# EAGLE design StartLightGate2022 (EAGLE 9.6.2)
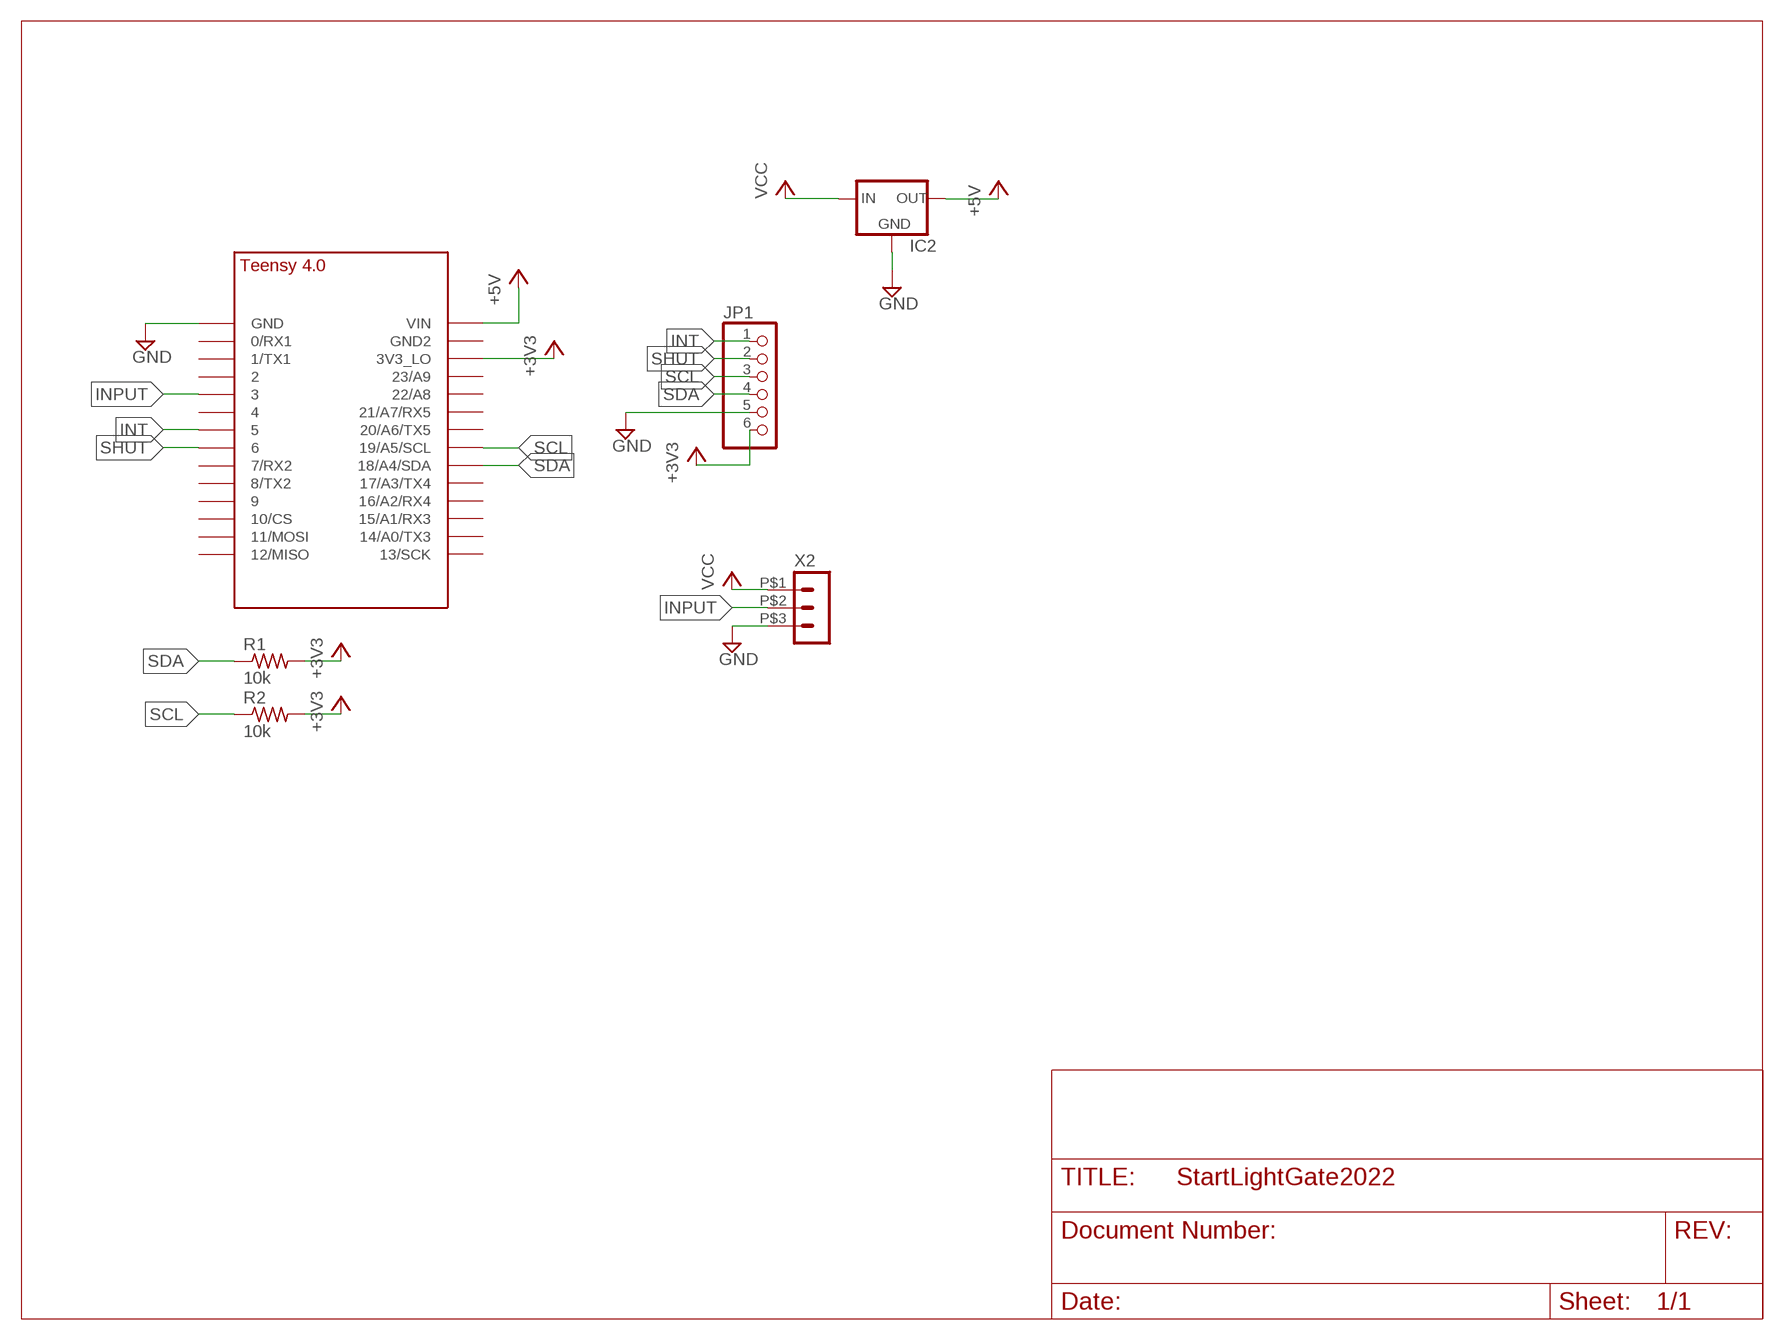
[diagram p0: schematic, sheet 1]

## Parts
IC2  REG_5V_L7805_HOR  [TO-220-H]
JP1  PINHD-1X6  [1X06]
R1  10k  RES_AXIAL1/4W-0.4  [1/4W-0.4]
R2  10k  RES_AXIAL1/4W-0.4  [1/4W-0.4]
U$1  TEENSY_4.0_SIMPLE  [TEENSY_4.0_SIMPLE]
X2  HEADER_POS3_43650-0300  [43650-0300]

## Nets
+3V3: JP1.6 R1.2 R2.2 U$1.3V3_LO
+5V: IC2.3(OUT) U$1.VIN
GND: IC2.2(GND) JP1.5 U$1.GND X2.P$3
INPUT: U$1.3/CANTX X2.P$2
INT: JP1.1 U$1.5
SCL: JP1.3 R2.1 U$1.19/A5/SCL
SDA: JP1.4 R1.1 U$1.18/A4/SDA
SHUT: JP1.2 U$1.6
VCC: IC2.1(IN) X2.P$1
Unconnected: U$1.0/RX(0/RX1) U$1.1/TX(1/TX1) U$1.2 U$1.4/CANRX U$1.7(7/RX2) U$1.8(8/TX2) U$1.9/CS U$1.10/CS U$1.11/MOSI U$1.12/MISO U$1.13/SCK U$1.14/A0(14/A0/TX3) U$1.15/A1(15/A1/RX3) U$1.16/A2(16/A2/RX4) U$1.17/A3(17/A3/TX4) U$1.20/A6(20/A6/TX5) U$1.21/A7(21/A7/RX5) U$1.22/A8 U$1.23/A9 U$1.GND2

## Library data of the parts
IC2 = GTOR - Active Components:REG_5V_L7805: Voltage Regulator Switching 5v regulator Datasheet <http://power.murata.com/data/power/oki-78sr.pdf> Standard 7805 5V regulator. IGO (Input Ground Output). Spark Fun Electronics SKU : COM-00107 Datasheet <http://www.mouser.com/ds/2/308/MC7800-D-94905.pdf>
JP1 = GTOR - Connectors:PINHD-1X6: PIN HEADER
R1 R2 = GTOR - Passive Components:RES_AXIAL: RESISTOR, American symbol; SPICEPREFIX: R
U$1 = GTOR - Microcontroller:TEENSY_4.0_SIMPLE
X2 = GTOR - Microfit Connector:HEADER_POS3_?: Molex - Micro-Fit 3.0 Series connector, 3.00mm (0.118") pitch header, 3 positions.

## Board
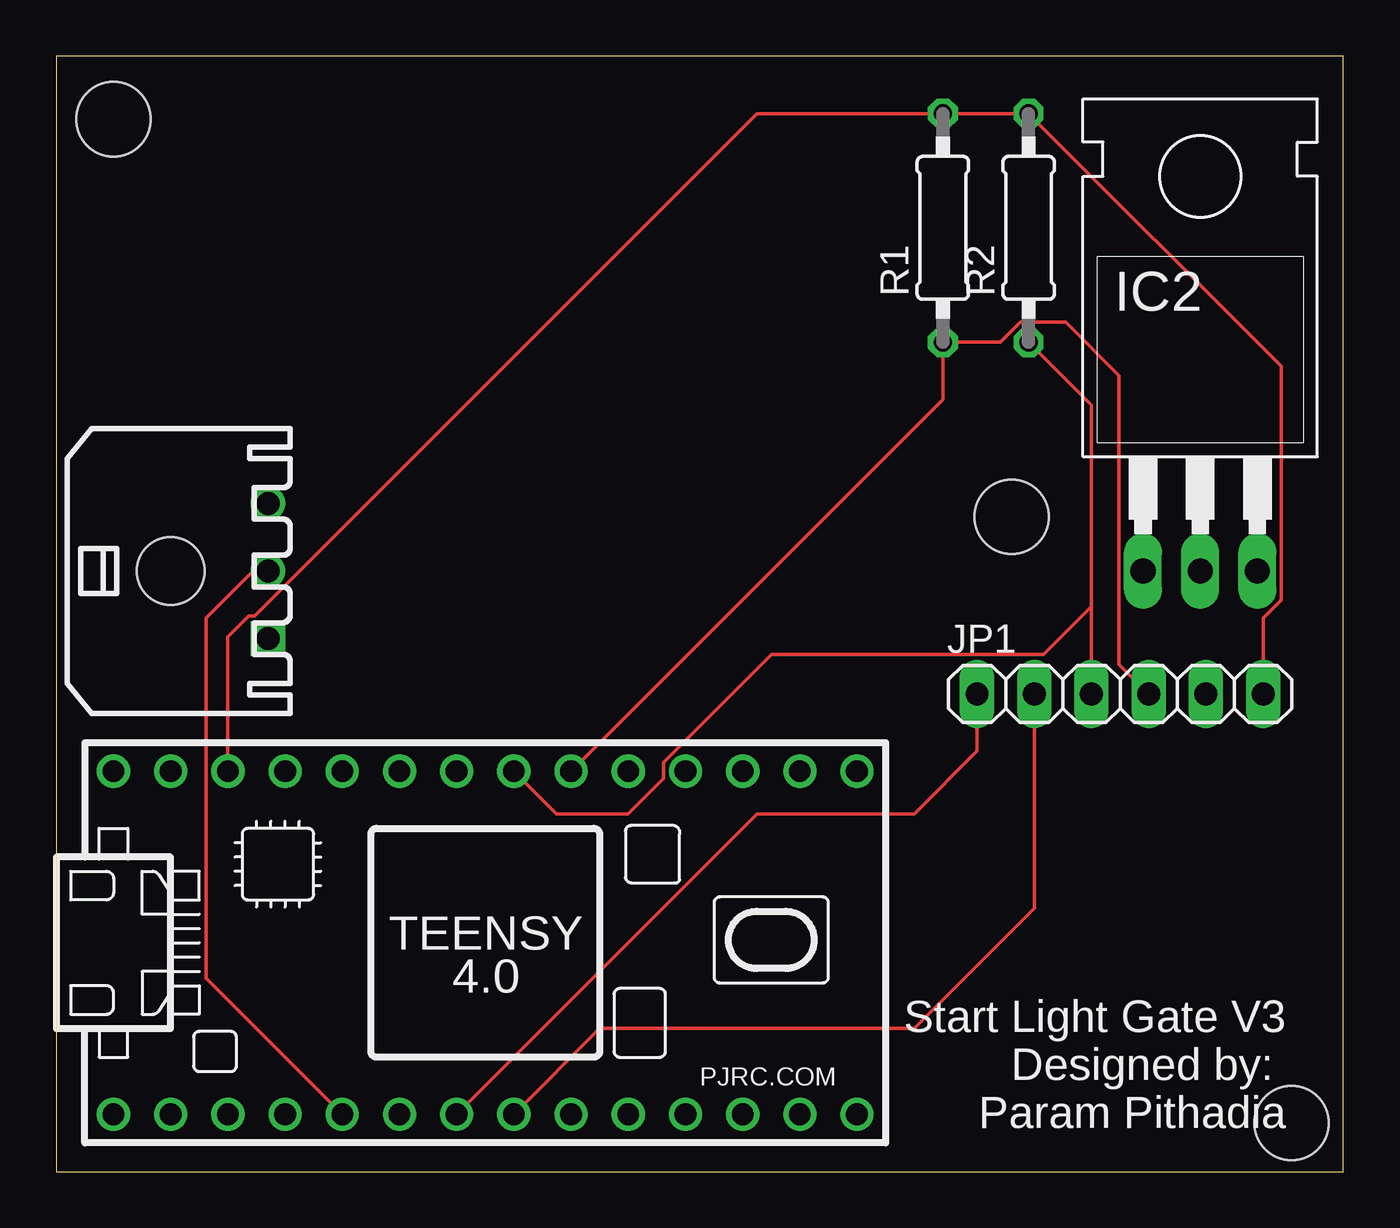
[diagram p1: board, top side]
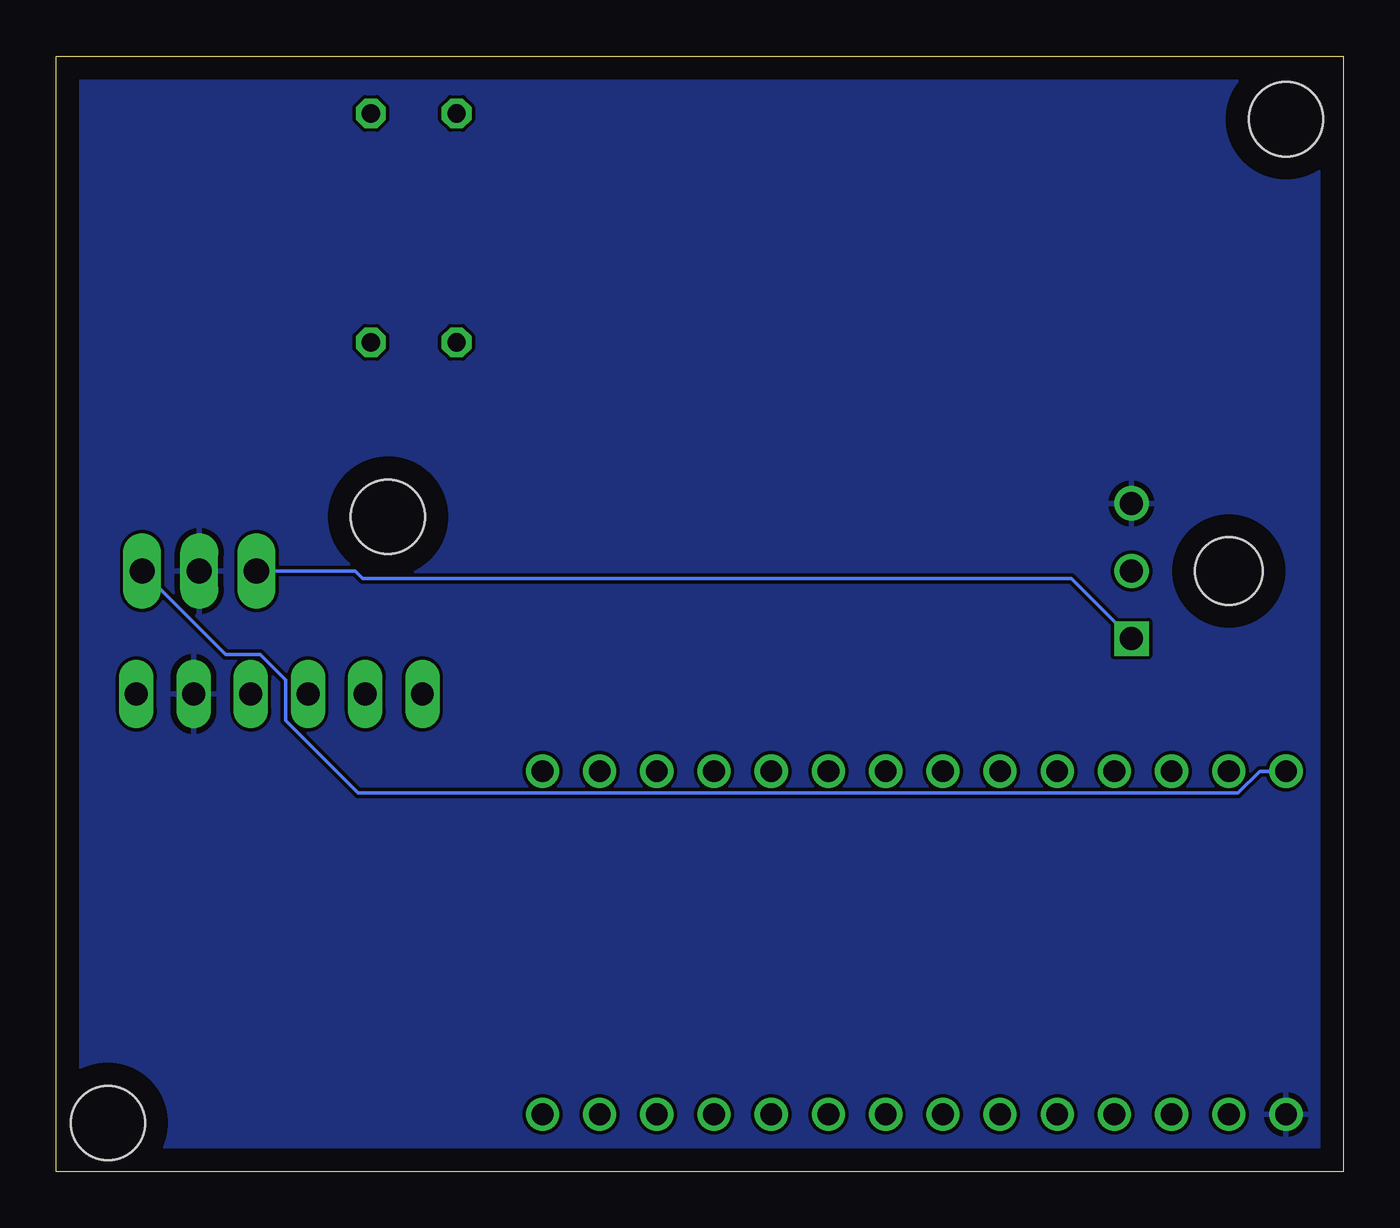
[diagram p2: board, bottom side, seen from below]

Size 57.15 x 49.53 mm. Coordinates in mm from the lower left corner, seen from the top.
Outline: 0,0 57.15,0 57.15,49.53 0,49.53 0,0
Copper layers (1*16): Top 0.035mm / dielectric 1.5mm / Bottom 0.035mm
Design rules "default": minimum track width 6mil, minimum drill 0.35mm, track to track 6mil, track to pad 6mil, pad to pad 6mil, via to via 6mil, smd to smd 6mil, copper to edge 40mil, drill to drill 6mil, minimum pad ring 10mil, minimum via ring 8mil, stop-mask expansion 4mil, vias tented up to drill 0mil, thermal gap 10mil
Holes 3.3 mm at 2.54,46.74 42.42,29.08 54.86,2.16

### Footprints (pad centres in the part's own frame; a part is rotated, then mirrored left to right if it is on the bottom)
TO-220-H = drill 1.118 long: 1 -2.54,-6.35; 2 0,-6.35; 3 2.54,-6.35
1X06 = drill 1.016 long: 1 -6.35,0; 2 -3.81,0; 3 -1.27,0; 4 1.27,0; 5 3.81,0; 6 6.35,0
1/4W-0.4 = drill 0.813 octagon: 1 -5.08,0; 2 5.08,0
TEENSY_4.0_SIMPLE = drill 0.965: 0/RX -13.97,-7.62; 1/TX -11.43,-7.62; 2 -8.89,-7.62; 3/CANTX -6.35,-7.62; 3V3_LO -11.43,7.62; 4/CANRX -3.81,-7.62; 5 -1.27,-7.62; 6 1.27,-7.62; 7 3.81,-7.62; 8 6.35,-7.62; 9/CS 8.89,-7.62; 10/CS 11.43,-7.62; 11/MOSI 13.97,-7.62; 12/MISO 16.51,-7.62; 13/SCK 16.51,7.62; 14/A0 13.97,7.62; 15/A1 11.43,7.62; 16/A2 8.89,7.62; 17/A3 6.35,7.62; 18/A4/SDA 3.81,7.62; 19/A5/SCL 1.27,7.62; 20/A6 -1.27,7.62; 21/A7 -3.81,7.62; 22/A8 -6.35,7.62; 23/A9 -8.89,7.62; GND -16.51,-7.62; GND2 -13.97,7.62; VIN -16.51,7.62
43650-0300 = drill 1.02 square: P$1 3,4.32 | drill 1.02: P$2 0,4.32; P$3 -3,4.32 | hole 3: 0,0

### Placement (x,y rotation side)
IC2  50.8,33.02 0 top
JP1  47.24,21.21 0 top
R1  [1/4W-0.4]  39.37,41.91 90 top
R2  [1/4W-0.4]  43.18,41.91 90 top
U$1  19.05,10.16 0 top
X2  5.08,26.67 270 top

### Tracks (layer width: path | path; a pad name or v marks a point on that pad's centre or on a via)
+3V3
  Top 0.152: U$1.3V3_LO 7.62,23.74 8.54,24.66 8.8,24.66 31.12,46.99 R1.2 R2.2 54.41,35.76 54.41,25.39 53.59,24.58 JP1.6
+5V
  Bottom 0.152: IC2.3 49.63,22.96 48.1,22.96 46.97,21.82 46.97,20.04 43.74,16.82 4.68,16.82 3.71,17.78 U$1.VIN
GND
  pour Bottom: -5.08,53.98 59.05,53.98 61.59,51.44 61.59,-1.27 -2.54,-1.27 -5.08,1.27
INPUT
  Top 0.152: U$1.3/CANTX 6.66,8.59 6.66,24.58 8.75,26.67 X2.P$2
INT
  Top 0.152: U$1.5 31.11,15.88 38.1,15.88 40.89,18.67 JP1.1
SCL
  Top 0.152: R2.1 45.97,34.04 45.97,25.4 45.97,25.09 | 45.97,25.09 JP1.3 | U$1.19/A5/SCL 22.23,15.88 25.4,15.88 26.98,17.45 26.98,18.18 31.76,22.96 43.84,22.96 45.97,25.09
SDA
  Top 0.152: JP1.4 47.19,22.53 47.19,35.36 44.83,37.72 42.81,37.72 41.92,36.83 R1.1 39.37,34.29 U$1.18/A4/SDA
SHUT
  Top 0.152: U$1.6 24.13,6.35 38.1,6.35 43.43,11.68 JP1.2
VCC
  Bottom 0.152: IC2.1 43.88,26.67 43.55,26.34 12.07,26.34 X2.P$1

### Text on the board
tNames: Start Light Gate V3 / Designed by: / Param Pithadia